# Altium schematic sheet 769BI_LTDC.SchDoc: Наименование
size 420 x 297 mm; ApprovedBy: Утвердил; CheckedBy: Проверил; Author: Разработал; CompanyName: Организация; DrawnBy: Н.Контр; Engineer: Т.Контр; SheetNumber: 1; SheetTotal: 1; PageSetup: Record=PageOptions|CenterHorizontal=True|CenterVertical=True|PrintScale=0.94|XCorrection=1.00|YCorrection=1.00|PrintKind=1|BorderSize=5000000|LeftOffset=0|BottomOffset=0|Orientation=1|PaperLength=1000|PaperWidth=1000|Scale=100|PaperSource=7|PrintQuality=-4|MediaType=1|DitherType=10|PaperKind=A4|PrintScaleMode=1; DecimalNumber: Децимальный номер; HeadOfSector: Нач. сектора; MainDevice: Перв.примен.; Name: Наименование; DocumentName: Sheet1.SCHDOC
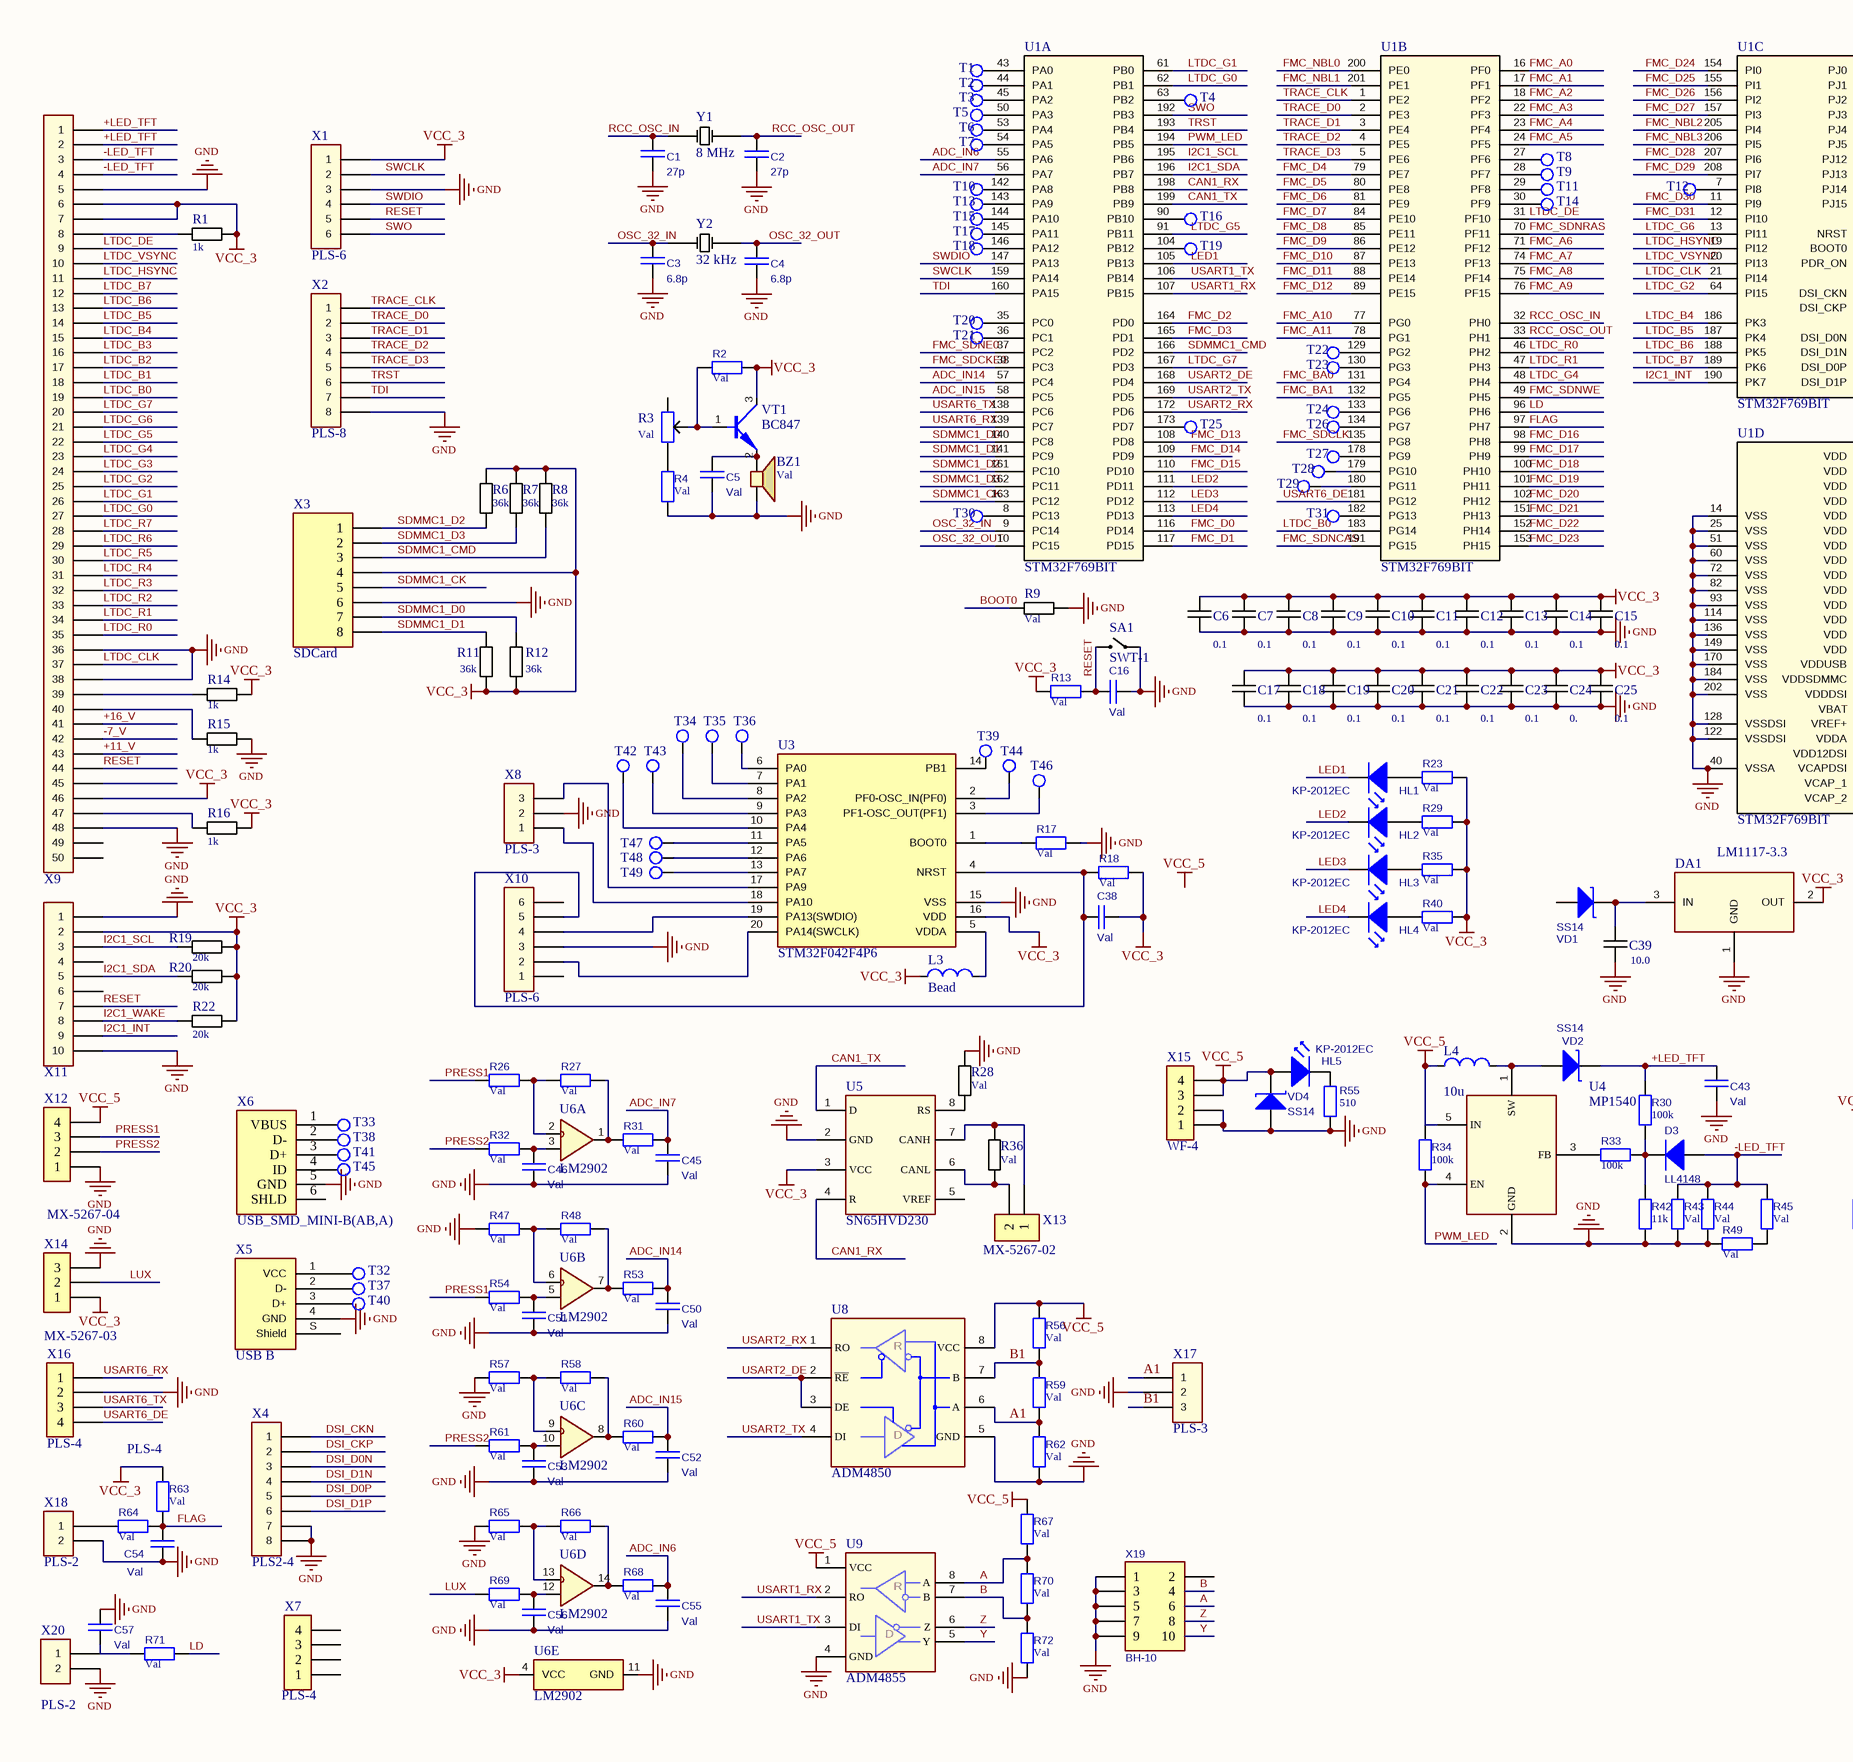
[diagram p0: 769BI_LTDC.SchDoc, left]
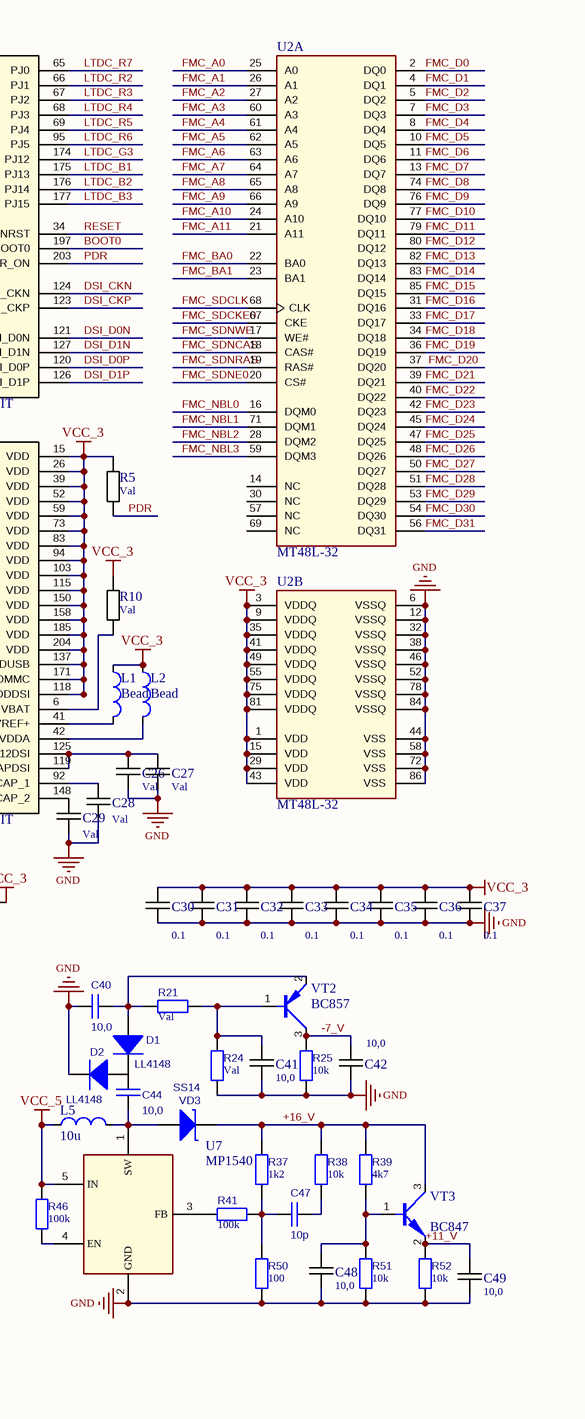
[diagram p1: 769BI_LTDC.SchDoc, right]

## Parts
BZ1  Val
C1  27p  [CAP0805]
C2  27p  [CAP0805]
C3  6.8p  [CAP0805]
C4  6.8p  [CAP0805]
C5  Val  [CAP0805]
C6  0.1  [CAP0805]
C7  0.1  [CAP0805]
C8  0.1  [CAP0805]
C9  0.1  [CAP0805]
C10  0.1  [CAP0805]
C11  0.1  [CAP0805]
C12  0.1  [CAP0805]
C13  0.1  [CAP0805]
C14  0.1  [CAP0805]
C15  0.1  [CAP0805]
C16  Val  [CAP0805]
C17  0.1  [CAP0805]
C18  0.1  [CAP0805]
C19  0.1  [CAP0805]
C20  0.1  [CAP0805]
C21  0.1  [CAP0805]
C22  0.1  [CAP0805]
C23  0.1  [CAP0805]
C24  0.  [CAP0805]
C25  0.1  [CAP0805]
C26  Val  [CAP0805]
C27  Val  [CAP0805]
C28  Val  [CAP0805]
C29  Val  [CAP0805]
C30  0.1  [CAP0805]
C31  0.1  [CAP0805]
C32  0.1  [CAP0805]
C33  0.1  [CAP0805]
C34  0.1  [CAP0805]
C35  0.1  [CAP0805]
C36  0.1  [CAP0805]
C37  0.1  [CAP0805]
C38  Val  [CAP0805]
C39  10.0  [CAP0805]
C40  10,0  [CAP0805]
C41  10,0  [CAP0805]
C42  10,0  [CAP0805]
C43  Val  [CAP0805]
C44  10,0  [CAP0805]
C45  Val  [CAP0805]
C46  Val  [CAP0805]
C47  10p  [CAP0805]
C48  10,0  [CAP0805]
C49  10,0  [CAP0805]
C50  Val  [CAP0805]
C51  Val  [CAP0805]
C52  Val  [CAP0805]
C53  Val  [CAP0805]
C54  Val  [CAP0805]
C55  Val  [CAP0805]
C56  Val  [CAP0805]
C57  Val  [CAP0805]
D1  LL4148  [SOD-80]
D2  LL4148  [SOD-80]
D3  LL4148  [SOD-80]
DA1  LM1117-3.3  [SOT233]
HL1  KP-2012EC  [LED_SMD]
HL2  KP-2012EC  [LED_SMD]
HL3  KP-2012EC  [LED_SMD]
HL4  KP-2012EC  [LED_SMD]
HL5  KP-2012EC  [LED_SMD]
L1  Bead  [RES0603]
L2  Bead  [RES0603]
L3  Bead  [RES0603]
L4  10u  [L_CDRH74-100]
L5  10u  [L_CDRH74-100]
R1  1k  [RES0805]
R2  Val  [RES0805]
R3  Val  [RES_VAR]
R4  Val  [RES0805]
R5  Val  [RES0805]
R6  36k  [RES0805]
R7  36k  [RES0805]
R8  36k  [RES0805]
R9  Val  [RES0805]
R10  Val  [RES0805]
R11  36k  [RES0805]
R12  36k  [RES0805]
R13  Val  [RES0805]
R14  1k  [RES0805]
R15  1k  [RES0805]
R16  1k  [RES0805]
R17  Val  [RES0805]
R18  Val  [RES0805]
R19  20k  [RES0805]
R20  20k  [RES0805]
R21  Val  [RES0805]
R22  20k  [RES0805]
R23  Val  [RES0805]
R24  Val  [RES0805]
R25  10k  [RES0805]
R26  Val  [RES0805]
R27  Val  [RES0805]
R28  Val  [RES0805]
R29  Val  [RES0805]
R30  100k  [RES0805]
R31  Val  [RES0805]
R32  Val  [RES0805]
R33  100k  [RES0805]
R34  100k  [RES0805]
R35  Val  [RES0805]
R36  Val  [RES0805]
R37  1k2  [RES0805]
R38  10k  [RES0805]
R39  4k7  [RES0805]
R40  Val  [RES0805]
R41  100k  [RES0805]
R42  11k  [RES0805]
R43  Val  [RES0805]
R44  Val  [RES0805]
R45  Val  [RES0805]
R46  100k  [RES0805]
R47  Val  [RES0805]
R48  Val  [RES0805]
R49  Val  [RES0805]
R50  100  [RES0805]
R51  10k  [RES0805]
R52  10k  [RES0805]
R53  Val  [RES0805]
R54  Val  [RES0805]
R55  510  [RES0805]
R56  Val  [RES0805]
R57  Val  [RES0805]
R58  Val  [RES0805]
R59  Val  [RES0805]
R60  Val  [RES0805]
R61  Val  [RES0805]
R62  Val  [RES0805]
R63  Val  [RES0805]
R64  Val  [RES0805]
R65  Val  [RES0805]
R66  Val  [RES0805]
R67  Val  [RES0805]
R68  Val  [RES0805]
R69  Val  [RES0805]
R70  Val  [RES0805]
R71  Val  [RES0805]
R72  Val  [RES0805]
SA1  SWT-1  [SWT-1]
T1  T  [Test]  (value not drawn)
T2  T  [Test]  (value not drawn)
T3  T  [Test]  (value not drawn)
T4  T  [Test]  (value not drawn)
T5  T  [Test]  (value not drawn)
T6  T  [Test]  (value not drawn)
T7  T  [Test]  (value not drawn)
T8  T  [Test]  (value not drawn)
T9  T  [Test]  (value not drawn)
T10  T  [Test]  (value not drawn)
T11  T  [Test]  (value not drawn)
T12  T  [Test]  (value not drawn)
T13  T  [Test]  (value not drawn)
T14  T  [Test]  (value not drawn)
T15  T  [Test]  (value not drawn)
T16  T  [Test]  (value not drawn)
T17  T  [Test]  (value not drawn)
T18  T  [Test]  (value not drawn)
T19  T  [Test]  (value not drawn)
T20  T  [Test]  (value not drawn)
T21  T  [Test]  (value not drawn)
T22  T  [Test]  (value not drawn)
T23  T  [Test]  (value not drawn)
T24  T  [Test]  (value not drawn)
T25  T  [Test]  (value not drawn)
T26  T  [Test]  (value not drawn)
T27  T  [Test]  (value not drawn)
T28  T  [Test]  (value not drawn)
T29  T  [Test]  (value not drawn)
T30  T  [Test]  (value not drawn)
T31  T  [Test]  (value not drawn)
T32  T  [Test]  (value not drawn)
T33  T  [Test]  (value not drawn)
T34  T  [Test]  (value not drawn)
T35  T  [Test]  (value not drawn)
T36  T  [Test]  (value not drawn)
T37  T  [Test]  (value not drawn)
T38  T  [Test]  (value not drawn)
T39  T  [Test]  (value not drawn)
T40  T  [Test]  (value not drawn)
T41  T  [Test]  (value not drawn)
T42  T  [Test]  (value not drawn)
T43  T  [Test]  (value not drawn)
T44  T  [Test]  (value not drawn)
T45  T  [Test]  (value not drawn)
T46  T  [Test]  (value not drawn)
T47  T  [Test]  (value not drawn)
T48  T  [Test]  (value not drawn)
T49  T  [Test]  (value not drawn)
U1  STM32F769BIT  [STM-LQFP208_M]  (parts A,B,C,D of 4)
U2  MT48L-32  [MICT-P-86_N]  (parts A,B of 2)
U3  STM32F042F4P6  [STM-TSSOP20_M]
U4  MP1540  [SOT23-5]
U5  SN65HVD230  [SO8-150]
U6  LM2902  [SO14-150]  (parts A,B,C,D,E of 5)
U7  MP1540  [SOT23-5]
U8  ADM4850  [SO8-150]
U9  ADM4855  [SO8-150]
VD1  SS14  [SK55AFL-TP_LOW]
VD2  SS14  [SK55AFL-TP_LOW]
VD3  SS14  [SK55AFL-TP_LOW]
VD4  SS14  [SK55AFL-TP_LOW]
VT1  value BC847  [SOT23]  (hidden comment: T_npn)
VT2  BC857  [SOT23]
VT3  value BC847  [SOT23]  (hidden comment: T_npn)
X1  PLS-6  [PLC-6]
X2  PLS-8  [PLC-8]
X3  SDCard  [47219-2001]
X4  PLS2-4  [PLS2x4]
X5  USB B  [USB 61729-0010BLF]
X6  USB_SMD_MINI-B(AB,A)  [USB_SMD_MINI-B(AB,A)]
X7  PLS-4  [PLC-4]
X8  value PLS-3  [PLC-3]
X9  (no value)  [FPC50]
X10  PLS-6  [PLC-6]
X11  (no value)  [FPC10]
X12  MX-5267-04  [MX-5267-04]
X13  MX-5267-02  [MX-5267-02]
X14  MX-5267-03  [MX-5267-03]
X15  WF-4  [WF-4]
X16  PLS-4  [PLC-4]
X17  value PLS-3  [PLC-3]
X18  value PLS-2  [PLC-2]
X19  BH-10  [BH-10]
X20  value PLS-2  [PLC-2]
Y1  8 MHz  [OSC_8]
Y2  32 kHz  [OSC_32kHz]

## Nets
GND: BZ1.2 C1.1 C2.1 C3.1 C4.1 C5.1 C6.1 C7.1 C8.1 C9.2 C10.2 C11.2 C12.2 C13.2 C14.2 C15.2 C16.1 C17.1 C18.1 C19.2 C20.2 C21.2 C22.2 C23.2 C24.2 C25.2 C26.1 C27.1 C28.1 C29.1 C30.1 C31.2 C32.2 C33.2 C34.2 C35.2 C36.2 C37.2 C39.1 C40.2 C41.1 C42.1 C43.1 C45.1 C46.1 C48.1 C49.1 C50.1 C51.1 C52.1 C53.1 C54.1 C55.1 C56.1 C57.2 D2.2(CA) DA1.1(GND) R4.1 R9.2 R15.2 R17.1 R24.2 R25.2 R28.2 R42.1 R43.1 R44.1 R47.2 R49.2 R50.1 R51.1 R52.1 R55.1 R57.2 R62.2 R65.2 R72.2 SA1.2(OSC2) U1.14(VSS) U1.25(VSS) U1.40(VSSA) U1.51(VSS) U1.60(VSS) U1.72(VSS) U1.82(VSS) U1.93(VSS) U1.114(VSS) U1.122(VSSDSI) U1.128(VSSDSI) U1.136(VSS) U1.149(VSS) U1.170(VSS) U1.184(VSS) U1.202(VSS) U2.6(VSSQ) U2.12(VSSQ) U2.32(VSSQ) U2.38(VSSQ) U2.44(VSS) U2.46(VSSQ) U2.52(VSSQ) U2.58(VSS) U2.72(VSS) U2.78(VSSQ) U2.84(VSSQ) U2.86(VSS) U3.15(VSS) U4.2(GND) U5.2(GND) U6.11(GND) U7.2(GND) U8.5(GND) U9.4(GND) VD4.2(AN) X1.3 X2.8 X3.6 X4.7 X4.8 X5.4(GND) X6.5(GND) X8.2 X9.5 X9.36 X9.38 X9.48 X10.3 X11.1 X11.10 X12.1 X14.3 X15.1 X15.2 X16.2 X17.2 X18.2 X19.1 X19.3 X19.5 X19.7 X19.9 X20.2
VCC_3: C6.2 C7.2 C8.2 C9.1 C10.1 C11.1 C12.1 C13.1 C14.1 C15.1 C17.2 C18.2 C19.1 C20.1 C21.1 C22.1 C23.1 C24.1 C25.1 C30.2 C31.1 C32.1 C33.1 C34.1 C35.1 C36.1 C37.1 C38.1 DA1.2(OUT) L1.2 L2.2 L3.1 R1.2 R2.1 R5.1 R6.2 R7.2 R8.2 R10.1 R11.1 R12.2 R13.1 R14.2 R16.2 R18.1 R19.2 R20.2 R22.2 R23.1 R29.1 R35.1 R40.1 R63.2 U1.15(VDD) U1.26(VDD) U1.39(VDD) U1.52(VDD) U1.59(VDD) U1.73(VDD) U1.83(VDD) U1.94(VDD) U1.103(VDD) U1.115(VDD) U1.118(VDDDSI) U1.137(VDDUSB) U1.150(VDD) U1.158(VDD) U1.171(VDDSDMMC) U1.185(VDD) U1.204(VDD) U2.1(VDD) U2.3(VDDQ) U2.9(VDDQ) U2.15(VDD) U2.29(VDD) U2.35(VDDQ) U2.41(VDDQ) U2.43(VDD) U2.49(VDDQ) U2.55(VDDQ) U2.75(VDDQ) U2.81(VDDQ) U3.16(VDD) U5.3(VCC) U6.4(VCC) VT1.3(C) X1.1 X3.4 X9.6 X9.7 X9.46 X11.2 X14.1
VCC_5: HL5.1(AN) L4.1 L5.1 R34.2 R46.2 R56.1 R67.1 U4.5(IN) U7.5(IN) U8.8(VCC) U9.1(VCC) VD4.1(CA) X12.4 X15.3 X15.4
+11_V: C49.2 R52.2 VT3.2(E) X9.43
+16_V: R37.2 R38.2 R39.2 VD3.1(CA) VT3.3(C) X9.41
+LED_TFT: C43.2 R30.2 VD2.1(CA) X9.1 X9.2
-7_V: C42.2 R25.1 VT2.3(C) X9.42
-LED_TFT: D3.1(AN) R43.2 R44.2 R45.2 X9.3 X9.4
A: R67.2 R70.1 U9.8(A) X19.6
A1: R59.2 R62.1 U8.6(A) X17.1
ADC_IN6: C55.2 R68.1 U1.55(PA6)
ADC_IN7: C45.2 R31.1 U1.56(PA7)
ADC_IN14: C50.2 R53.1 U1.57(PC4)
ADC_IN15: C52.2 R60.1 U1.58(PC5)
B: R70.2 R72.1 U9.7(B) X19.4
B1: R56.2 R59.1 U8.7(B) X17.3
BOOT0: R9.1 U1.197(BOOT0)
CAN1_RX: U1.198(PB8) U5.4(R)
CAN1_TX: U1.199(PB9) U5.1(D)
DSI_CKN: U1.124(DSI_CKN) X4.1
DSI_CKP: U1.123(DSI_CKP) X4.2
DSI_D0N: U1.121(DSI_D0N) X4.3
DSI_D0P: U1.120(DSI_D0P) X4.5
DSI_D1N: U1.127(DSI_D1N) X4.4
DSI_D1P: U1.126(DSI_D1P) X4.6
FLAG: C54.2 R63.1 R64.2 U1.97(PH7)
FMC_A0: U1.16(PF0) U2.25(A0)
FMC_A1: U1.17(PF1) U2.26(A1)
FMC_A2: U1.18(PF2) U2.27(A2)
FMC_A3: U1.22(PF3) U2.60(A3)
FMC_A4: U1.23(PF4) U2.61(A4)
FMC_A5: U1.24(PF5) U2.62(A5)
FMC_A6: U1.71(PF12) U2.63(A6)
FMC_A7: U1.74(PF13) U2.64(A7)
FMC_A8: U1.75(PF14) U2.65(A8)
FMC_A9: U1.76(PF15) U2.66(A9)
FMC_A10: U1.77(PG0) U2.24(A10)
FMC_A11: U1.78(PG1) U2.21(A11)
FMC_BA0: U1.131(PG4) U2.22(BA0)
FMC_BA1: U1.132(PG5) U2.23(BA1)
FMC_D0: U1.116(PD14) U2.2(DQ0)
FMC_D1: U1.117(PD15) U2.4(DQ1)
FMC_D2: U1.164(PD0) U2.5(DQ2)
FMC_D3: U1.165(PD1) U2.7(DQ3)
FMC_D4: U1.79(PE7) U2.8(DQ4)
FMC_D5: U1.80(PE8) U2.10(DQ5)
FMC_D6: U1.81(PE9) U2.11(DQ6)
FMC_D7: U1.84(PE10) U2.13(DQ7)
FMC_D8: U1.85(PE11) U2.74(DQ8)
FMC_D9: U1.86(PE12) U2.76(DQ9)
FMC_D10: U1.87(PE13) U2.77(DQ10)
FMC_D11: U1.88(PE14) U2.79(DQ11)
FMC_D12: U1.89(PE15) U2.80(DQ12)
FMC_D13: U1.108(PD8) U2.82(DQ13)
FMC_D14: U1.109(PD9) U2.83(DQ14)
FMC_D15: U1.110(PD10) U2.85(DQ15)
FMC_D16: U1.98(PH8) U2.31(DQ16)
FMC_D17: U1.99(PH9) U2.33(DQ17)
FMC_D18: U1.100(PH10) U2.34(DQ18)
FMC_D19: U1.101(PH11) U2.36(DQ19)
FMC_D20: U1.102(PH12) U2.37(DQ20)
FMC_D21: U1.151(PH13) U2.39(DQ21)
FMC_D22: U1.152(PH14) U2.40(DQ22)
FMC_D23: U1.153(PH15) U2.42(DQ23)
FMC_D24: U1.154(PI0) U2.45(DQ24)
FMC_D25: U1.155(PI1) U2.47(DQ25)
FMC_D26: U1.156(PI2) U2.48(DQ26)
FMC_D27: U1.157(PI3) U2.50(DQ27)
FMC_D28: U1.207(PI6) U2.51(DQ28)
FMC_D29: U1.208(PI7) U2.53(DQ29)
FMC_D30: U1.11(PI9) U2.54(DQ30)
FMC_D31: U1.12(PI10) U2.56(DQ31)
FMC_NBL0: U1.200(PE0) U2.16(DQM0)
FMC_NBL1: U1.201(PE1) U2.71(DQM1)
FMC_NBL2: U1.205(PI4) U2.28(DQM2)
FMC_NBL3: U1.206(PI5) U2.59(DQM3)
FMC_SDCKE0: U1.38(PC3) U2.67(CKE)
FMC_SDCLK: U1.135(PG8) U2.68(CLK)
FMC_SDNCAS: U1.191(PG15) U2.18(CAS#)
FMC_SDNE0: U1.37(PC2) U2.20(CS#)
FMC_SDNRAS: U1.70(PF11) U2.19(RAS#)
FMC_SDNWE: U1.49(PH5) U2.17(WE#)
I2C1_INT: U1.190(PK7) X11.9
I2C1_SCL: R19.1 U1.195(PB6) X11.3
I2C1_SDA: R20.1 U1.196(PB7) X11.5
I2C1_WAKE: R22.1 X11.8
LD: R71.2 U1.96(PH6)
LED1: HL1.2(CA) U1.105(PB13)
LED2: HL2.2(CA) U1.111(PD11)
LED3: HL3.2(CA) U1.112(PD12)
LED4: HL4.2(CA) U1.113(PD13)
LTDC_B0: U1.183(PG14) X9.19
LTDC_B1: U1.175(PJ13) X9.18
LTDC_B2: U1.176(PJ14) X9.17
LTDC_B3: U1.177(PJ15) X9.16
LTDC_B4: U1.186(PK3) X9.15
LTDC_B5: U1.187(PK4) X9.14
LTDC_B6: U1.188(PK5) X9.13
LTDC_B7: U1.189(PK6) X9.12
LTDC_CLK: U1.21(PI14) X9.37
LTDC_DE: U1.31(PF10) X9.9
LTDC_G0: U1.62(PB1) X9.27
LTDC_G1: U1.61(PB0) X9.26
LTDC_G2: U1.64(PI15) X9.25
LTDC_G3: U1.174(PJ12) X9.24
LTDC_G4: U1.48(PH4) X9.23
LTDC_G5: U1.91(PB11) X9.22
LTDC_G6: U1.13(PI11) X9.21
LTDC_G7: U1.167(PD3) X9.20
LTDC_HSYNC: U1.19(PI12) X9.11
LTDC_R0: U1.46(PH2) X9.35
LTDC_R1: U1.47(PH3) X9.34
LTDC_R2: U1.66(PJ1) X9.33
LTDC_R3: U1.67(PJ2) X9.32
LTDC_R4: U1.68(PJ3) X9.31
LTDC_R5: U1.69(PJ4) X9.30
LTDC_R6: U1.95(PJ5) X9.29
LTDC_R7: U1.65(PJ0) X9.28
LTDC_VSYNC: U1.20(PI13) X9.10
LUX: R69.2 X14.2
OSC_32_IN: C3.2 U1.9(PC14) Y2.1(OSC1)
OSC_32_OUT: C4.2 U1.10(PC15) Y2.2(OSC2)
PDR: R5.2 U1.203(PDR_ON)
PRESS1: R26.2 R54.2 X12.3
PRESS2: R32.2 R61.2 X12.2
PWM_LED: R34.1 U1.194(PB5) U4.4(EN)
RCC_OSC_IN: C1.2 U1.32(PH0) Y1.1(OSC1)
RCC_OSC_OUT: C2.2 U1.33(PH1) Y1.2(OSC2)
RESET: C16.2 R13.2 SA1.1(OSC1) U1.34(NRST) X1.5 X9.44 X11.7
SDMMC1_CK: U1.163(PC12) X3.5
SDMMC1_CMD: R8.1 U1.166(PD2) X3.3
SDMMC1_D0: R12.1 U1.140(PC8) X3.7
SDMMC1_D1: R11.2 U1.141(PC9) X3.8
SDMMC1_D2: R6.1 U1.161(PC10) X3.1
SDMMC1_D3: R7.1 U1.162(PC11) X3.2
SWCLK: U1.159(PA14) X1.2
SWDIO: U1.147(PA13) X1.4
SWO: U1.192(PB3) X1.6
TDI: U1.160(PA15) X2.7
TRACE_CLK: U1.1(PE2) X2.1
TRACE_D0: U1.2(PE3) X2.2
TRACE_D1: U1.3(PE4) X2.3
TRACE_D2: U1.4(PE5) X2.4
TRACE_D3: U1.5(PE6) X2.5
TRST: U1.193(PB4) X2.6
USART1_RX: U1.107(PB15) U9.2(RO)
USART1_TX: U1.106(PB14) U9.3(DI)
USART2_DE: U1.168(PD4) U8.2(~{RE}) U8.3(DE)
USART2_RX: U1.172(PD6) U8.1(RO)
USART2_TX: U1.169(PD5) U8.4(DI)
USART6_DE: U1.181(PG12) X16.4
USART6_RX: U1.139(PC7) X16.1
USART6_TX: U1.138(PC6) X16.3
Y: U9.5(Y) X19.10
Z: U9.6(Z) X19.8
NetBZ1_1: BZ1.1 C5.2 VT1.2(E)
NetC26_2: C26.2 C27.2 U1.119(VCAPDSI) U1.125(VDD12DSI)
NetC28_2: C28.2 U1.92(VCAP_1)
NetC29_2: C29.2 U1.148(VCAP_2)
NetC38_2: C38.2 R18.2 U3.4(NRST) X10.5
NetC39_2: C39.2 DA1.3(IN) VD1.1(CA)
NetC40_1: C40.1 D1.1(AN) R21.2 VT2.2(E)
NetC41_2: C41.2 R21.1 R24.1 VT2.1(B)
NetC44_1: C44.1 L5.2 U7.1(SW) VD3.2(AN)
NetC44_2: C44.2 D1.2(CA) D2.1(AN)
NetC46_2: C46.2 R32.1 U6.3
NetC47_1: C47.1 R37.1 R41.1 R50.2
NetC47_2: C47.2 R38.1
NetC48_2: C48.2 R39.1 R51.2 VT3.1(B)
NetC51_2: C51.2 R54.1 U6.5
NetC53_2: C53.2 R61.1 U6.10
NetC56_2: C56.2 R69.1 U6.12
NetC57_1: C57.1 R71.1 X20.1
NetD3_2: D3.2(CA) R30.1 R33.1 R42.2
NetHL1_1: HL1.1(AN) R23.2
NetHL2_1: HL2.1(AN) R29.2
NetHL3_1: HL3.1(AN) R35.2
NetHL4_1: HL4.1(AN) R40.2
NetHL5_2: HL5.2(CA) R55.2
NetL1_1: L1.1 U1.41(VREF+)
NetL2_1: L2.1 U1.42(VDDA)
NetL3_2: L3.2 U3.5(VDDA)
NetL4_2: L4.2 U4.1(SW) VD2.2(AN)
NetR1_1: R1.1 X9.8
NetR2_2: R2.2 R3.3 VT1.1(B)
NetR3_2: R3.2 R4.2
NetR10_2: R10.2 U1.6(VBAT)
NetR14_1: R14.1 X9.39
NetR15_1: R15.1 X9.40
NetR16_1: R16.1 X9.47
NetR17_2: R17.2 U3.1(BOOT0)
NetR26_1: R26.1 R27.2 U6.2
NetR27_1: R27.1 R31.2 U6.1
NetR28_1: R28.1 U5.8(RS)
NetR33_2: R33.2 U4.3(FB)
NetR36_1: R36.1 U5.6(CANL) X13.2
NetR36_2: R36.2 U5.7(CANH) X13.1
NetR41_2: R41.2 U7.3(FB)
NetR45_1: R45.1 R49.1
NetR46_1: R46.1 U7.4(EN)
NetR47_1: R47.1 R48.2 U6.6
NetR48_1: R48.1 R53.2 U6.7
NetR57_1: R57.1 R58.2 U6.9
NetR58_1: R58.1 R60.2 U6.8
NetR64_1: R64.1 X18.1
NetR65_1: R65.1 R66.2 U6.13
NetR66_1: R66.1 R68.2 U6.14
NetT1_1: T1.1 U1.43(PA0)
NetT2_1: T2.1 U1.44(PA1)
NetT3_1: T3.1 U1.45(PA2)
NetT4_1: T4.1 U1.63(PB2)
NetT5_1: T5.1 U1.50(PA3)
NetT6_1: T6.1 U1.53(PA4)
NetT7_1: T7.1 U1.54(PA5)
NetT8_1: T8.1 U1.27(PF6)
NetT9_1: T9.1 U1.28(PF7)
NetT10_1: T10.1 U1.142(PA8)
NetT11_1: T11.1 U1.29(PF8)
NetT12_1: T12.1 U1.7(PI8)
NetT13_1: T13.1 U1.143(PA9)
NetT14_1: T14.1 U1.30(PF9)
NetT15_1: T15.1 U1.144(PA10)
NetT16_1: T16.1 U1.90(PB10)
NetT17_1: T17.1 U1.145(PA11)
NetT18_1: T18.1 U1.146(PA12)
NetT19_1: T19.1 U1.104(PB12)
NetT20_1: T20.1 U1.35(PC0)
NetT21_1: T21.1 U1.36(PC1)
NetT22_1: T22.1 U1.129(PG2)
NetT23_1: T23.1 U1.130(PG3)
NetT24_1: T24.1 U1.133(PG6)
NetT25_1: T25.1 U1.173(PD7)
NetT26_1: T26.1 U1.134(PG7)
NetT27_1: T27.1 U1.178(PG9)
NetT28_1: T28.1 U1.179(PG10)
NetT29_1: T29.1 U1.180(PG11)
NetT30_1: T30.1 U1.8(PC13)
NetT31_1: T31.1 U1.182(PG13)
NetT32_1: T32.1 X5.1(VCC)
NetT33_1: T33.1 X6.1(VBUS)
NetT34_1: T34.1 U3.8(PA2)
NetT35_1: T35.1 U3.7(PA1)
NetT36_1: T36.1 U3.6(PA0)
NetT37_1: T37.1 X5.2(D-)
NetT38_1: T38.1 X6.2(D-)
NetT39_1: T39.1 U3.14(PB1)
NetT40_1: T40.1 X5.3(D+)
NetT41_1: T41.1 X6.3(D+)
NetT42_1: T42.1 U3.10(PA4)
NetT43_1: T43.1 U3.9(PA3)
NetT44_1: T44.1 U3.2(PF0-OSC_IN(PF0))
NetT45_1: T45.1 X6.4(ID)
NetT46_1: T46.1 U3.3(PF1-OSC_OUT(PF1))
NetT47_1: T47.1 U3.11(PA5)
NetT48_1: T48.1 U3.12(PA6)
NetT49_1: T49.1 U3.13(PA7)
NetU3_17: U3.17(PA9) X8.3
NetU3_18: U3.18(PA10) X8.1
NetU3_19: U3.19(PA13(SWDIO)) X10.4
NetU3_20: U3.20(PA14(SWCLK)) X10.2

Not connected (* = marked no-connect by the designer): R3 1; U2 14(NC) 30(NC) 57(NC) 69(NC); U5 5(VREF); VD1 2(AN); X5 S(Shield); X6 6(SHLD); X7 1 2 3 4; X9 45 49 50; X10 1 6; X11 4 6; X19 2

## Notes on the sheet
- Labels drawn without touching a wire or pin: VCC_5
- Перв.примен.
- Справ.№
- Подп. и дата
- Инв.№ дубл.
- Взам.инв.№
- Подп.и дата
- Разраб.
- Изм.
- Лист
- № докум.
- Подп.
- Дата
- Лит.
- Масштаб
- Масса
- Т.контр.
- Пров.
- СХЕМА   ЭЛЕКТРИЧЕСКАЯ
- ПРИНЦИПИАЛЬНАЯ
- Листов
- Инв.№ подл.
- Утв.
- Н.контр.
- Нач.сект.
- Формат  A3
- (in symbol ADM4850) R; D
- (in symbol ADM4855) R; D

## Library data of the parts
BZ1 = BUZZER: BUZ; Value: Val
C1-C57 = CAP_smd_0805: Capacitor; Published: 8-Jun-2000; LatestRevisionDate: 17-Jul-2002; LatestRevisionNote: Re-released for DXP Platform.; PackageReference: RAD-0.3; Publisher: Altium Limited; PackageDescription: Radial Cap, Thru-Hole; 2 Leads; 0.3 in Pin Spacing
  C1 C2: Value: 27p
  C3 C4: Value: 6.8p
  C5 C16 C26-C29 C38 C43 C45 C46 C50-C57: Value: Val
  C6-C15 C17-C23 C25 C30-C37: Value: 0.1
  C24: Value: 0.
  C39: Value: 10.0
  C40-C42 C44 C48 C49: Value: 10,0
  C47: Value: 10p
D1-D3 = Diod_SMD: Manufacturer 1: Kingbright; Manufacturer Part Number 1: APT2012CGCK; ComponentLink1Description: Datasheet; ComponentLink1URL: http://www.kingbrightusa.com/images/catalog/SPEC/APT2012CGCK.pdf; Operating temperature range: (-40 ... +85) °C; Supplier 1: Digikey; Supplier Part Number 1: 754-1127-6-ND; Supplier Unit Price 1: 1=0.47, 10=0.35, 25=0.28, 100=0.1855, 250=0.13124, 500=0.11200, 1000=0.08750 (USD); Type: LL4148
HL1-HL5 = LED_SMD: Manufacturer 1: Kingbright; Manufacturer Part Number 1: APT2012CGCK; ComponentLink1Description: Datasheet; ComponentLink1URL: http://www.kingbrightusa.com/images/catalog/SPEC/APT2012CGCK.pdf; Operating temperature range: (-40 ... +85) °C; Supplier 1: Digikey; Supplier Part Number 1: 754-1127-6-ND; Supplier Unit Price 1: 1=0.47, 10=0.35, 25=0.28, 100=0.1855, 250=0.13124, 500=0.11200, 1000=0.08750 (USD); Type: KP-2012EC
L1-L3 = BLM18RK102SN1D: Ferrite Bead; Manufacturer 1: Coilcraft; Manufacturer Part Number 1: CDRH74NP-100MC/SUMIDA; Tolerance: ±20%; Operating temperature range: (-40 ... +85) °C; ComponentLink1Description: Datasheet; ComponentLink1URL: http://www.mouser.com/ds/2/390/CDRH74-514269.pdf; Supplier 1: Digikey; Value: Bead
L4 L5 = L 10uH 1.84A SMT 7.5x7.5x4.5: CDRH74NP-100MC/SUMIDA; Manufacturer 1: Coilcraft; Tolerance: ±20%; Operating temperature range: (-40 ... +85) °C; Manufacturer Part Number 1: CDRH74NP-100MC/SUMIDA; ComponentLink1Description: Datasheet; ComponentLink1URL: http://www.mouser.com/ds/2/390/CDRH74-514269.pdf; Supplier 1: Digikey; Value: 10u
R1 R2 R4-R72 = RES_smd_0805: Resistor
  R1 R14-R16: Value: 1k
  R2 R4 R5 R9 R10 R13 R17 R18 R21 R23 R24 R26-R29 R31 R32 R35 R36 R40 R43-R45 R47-R49 R53 R54 R56-R72: Value: Val
  R6-R8 R11 R12: Value: 36k
  R19 R20 R22: Value: 20k
  R25 R38 R51 R52: Value: 10k
  R30 R33 R34 R41 R46: Value: 100k
  R37: Value: 1k2
  R39: Value: 4k7
  R42: Value: 11k
  R50: Value: 100
  R55: Value: 510
R3 = RES_VAR: Resistor; Value: Val
SA1 = SWT-1: Button; Published: 8-Jun-2000; LatestRevisionDate: 17-Jul-2002; LatestRevisionNote: Re-released for DXP Platform.; PackageReference: R38; Publisher: Altium Limited; PackageDescription: Crystal, Thru-Hole; 2 Leads; Body 3.1 x 8.2 mm (Dia.xH); Value: SWT-1
T1-T49 = Test: Value: T
U1 = STM32F769BIT: STM32F769BI; Manufacturer_Part_Number: stm32f769bxt; Vendor: STMicroelectronics; C: Copyright (C) 2016 Accelerated Designs. All rights reserved; Copyright: Copyright (C) 2016 Accelerated Designs. All rights reserved; Value: Value; Type: Type; RefDes: RefDes
U2 = MT48L-32: 256Mb PC133 SDR SDRAM, 16Mb x 16, 7.5ns, 3.3V, 0 to 70 degC, 54-Pin TSOP; Manufacturer: Micron; PartNumber: MT48LC16M16A2TG-75; CL: CL = 3; Clock Rate: 133 MHz; Op. Temp.: 0C to +70C; DatasheetVersion: Rev.Q; PackageVersion: Rev.Q; PackageReference: MICT-TG-54; PackageDescription: 54-Pin Thin Small Outline Package, 10.16 x 22.22 mm, Pitch 0.8 mm; Cycle Time: 7.5ns; Data Rate: PC133; Density: 256Mb; Depth: 16Mb; RoHS: 5/6; Voltage: 3.3V; Width: x16; Mounting Technology: Surface Mount; ComponentLink1Description: Manufacturer URL; ComponentLink1URL: http://www.micron.com/; ComponentLink2Description: Datasheet; ComponentLink2URL: http://www.micron.com/~/media/Documents/Products/Data%20Sheet/DRAM/256Mb_sdr.pdf; ComponentLink3Description: Package Specification; ComponentLink3URL: http://www.micron.com/~/media/Documents/Products/Data%20Sheet/DRAM/256Mb_sdr.pdf
U3 = STM32F042F4P6: ARM Cortex-M0 32-bit MCU, 16 KB Flash, 4 KB Internal RAM, 15 I/Os, 20-pin TSSOP, -40 to 85 degC, Tube; PartNumber: STM32F030F4P6; FLASH Size (Prog) (kB): 16; I/Os (High Current): 15; Internal RAM Size (kB): 4; Operating Frequency(F) (Processor speed) (MHz): 48; Supply Voltage(Vcc) min (V): 2.4; DatasheetVersion: Rev. 1; PackageVersion: Rev. 1, 11/2012; PackageReference: TSSOP20; PackageDescription: 20-Pin Thin Shrink Small Outline Package, 6.5 x 4.4 mm Body, 0.65 mm Pitch; Supplier 1: Digi-Key; Supplier Part Number 1: 497-14044-5-ND; Supplier 2: Newark; Supplier Part Number 2: 06X3648; Supplier 3: Mouser; Supplier Part Number 3: 511-STM32F030F4P6; Core: ARM Cortex-M0; Packing: Tube; Mounting Technology: Surface Mount; ComponentLink1Description: Manufacturer URL; ComponentLink1URL: http://www.st.com/web/en/home.html; ComponentLink2Description: Datasheet; ComponentLink2URL: http://www.st.com/st-web-ui/static/active/en/resource/technical/document/datasheet/DM00088500.pdf; ComponentLink3Description: Package Specification; ComponentLink3URL: http://www.st.com/st-web-ui/static/active/en/resource/technical/document/datasheet/DM00065136.pdf
U5 = SN65HVD230: CAN_driver; Value: SN65HVD230
U6 = LM2902: OA
U8 = ADM4850: RS485-half
U9 = ADM4855: RS485-full
VD1-VD4 = SK55AFL-TP: 5.0 Amp Schottky Rectifier; Manufacturer 1: Micro Commercial Co; ComponentLink1Description: Datasheet; ComponentLink1URL: http://www.mccsemi.com/up_pdf/SK52AFL-SK5200AFL(DO-221AC).pdf; Operating temperature range: (-55 ... +125) °C; Manufacturer Part Number 1: SK55AFL-TP; Supplier 1: Digikey; Supplier Part Number 1: SK55AFL-TPMSDKR-ND; Supplier Unit Price 1: 1=0.63, 10=0.527, 25=0.462, 100=0.3955, 250=0.34304, 500=0.29056, 1000=0.224 (USD); Type: SS14
VT1 VT3 = T_npn_BC847
VT2 = T_pnp_BC857: T_pnp; Value: BC857
X3 = 47219-2001: SD_Card_Holder
X5 = USB 2.0 Type B
X8 X17 = PLS-3
X9 = FFC_FPC_50_Pin_Top_Connect_0.5mm: LCD TFT connector
X11 = FFC_FPC_10_Pin_Top_Connect_0.5mm: Touch panel connector
X12 = MX-5267-04: Molex_4pin
X13 = MX-5267-02: Molex_2pin
X14 = MX-5267-03: Molex_3pin
X18 X20 = PLS-2
Y1 = XTAL: Crystal Oscillator; Published: 8-Jun-2000; LatestRevisionDate: 17-Jul-2002; LatestRevisionNote: Re-released for DXP Platform.; PackageReference: R38; Publisher: Altium Limited; PackageDescription: Crystal, Thru-Hole; 2 Leads; Body 3.1 x 8.2 mm (Dia.xH); Value: 8 MHz
Y2 = XTAL_32kHz: Crystal Oscillator; Published: 8-Jun-2000; LatestRevisionDate: 17-Jul-2002; LatestRevisionNote: Re-released for DXP Platform.; PackageReference: R38; Publisher: Altium Limited; PackageDescription: Crystal, Thru-Hole; 2 Leads; Body 3.1 x 8.2 mm (Dia.xH); Value: 32 kHz
DA1 = LM1117-3.3: Type: LM1117-3.3
X1 X10 = PLS-6: Type: PLS-6
X2 = PLS-8: Type: PLS-8
X4 = PLS2-4: Type: PLS2-4
X7 X16 = PLS-4: Value: PLS-4